# Altium schematic sheet dmpro16-pcb-v1-SDcard.SchDoc
size A4; DocumentNumber: 15; SheetNumber: 15; SheetTotal: 17; SheetName: SDcard
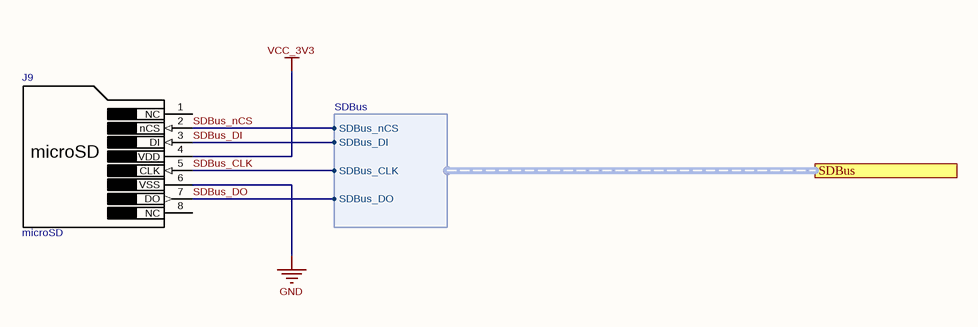
[diagram p0: dmpro16-pcb-v1-SDcard.SchDoc]

## Parts
J9  microSD  [114-00841-68-1-ND]

## Ports
SDBus (harness SDBus)

## Harnesses
SDBus: SDBus_nCS, SDBus_DI, SDBus_CLK, SDBus_DO

## Nets
GND: J9.6(VSS)
VCC_3V3: J9.4(VDD)
SDBus_CLK: J9.5(CLK) ; port SDBus.SDBus_CLK
SDBus_DI: J9.3(DI) ; port SDBus.SDBus_DI
SDBus_DO: J9.7(DO) ; port SDBus.SDBus_DO
SDBus_nCS: J9.2(nCS) ; port SDBus.SDBus_nCS

Not connected (* = marked no-connect by the designer): J9 1(NC) 8(NC)

## Notes on the sheet
- Board:
- Version:
- Sheetname:
- Subject:
- Group:
- Sheet
- of
- Shematic file:

## Library data of the parts
J9 = con_sd_microsd